# EasyEDA Pro project ProPrj_V1_2025-01-17.epro, board PCB1
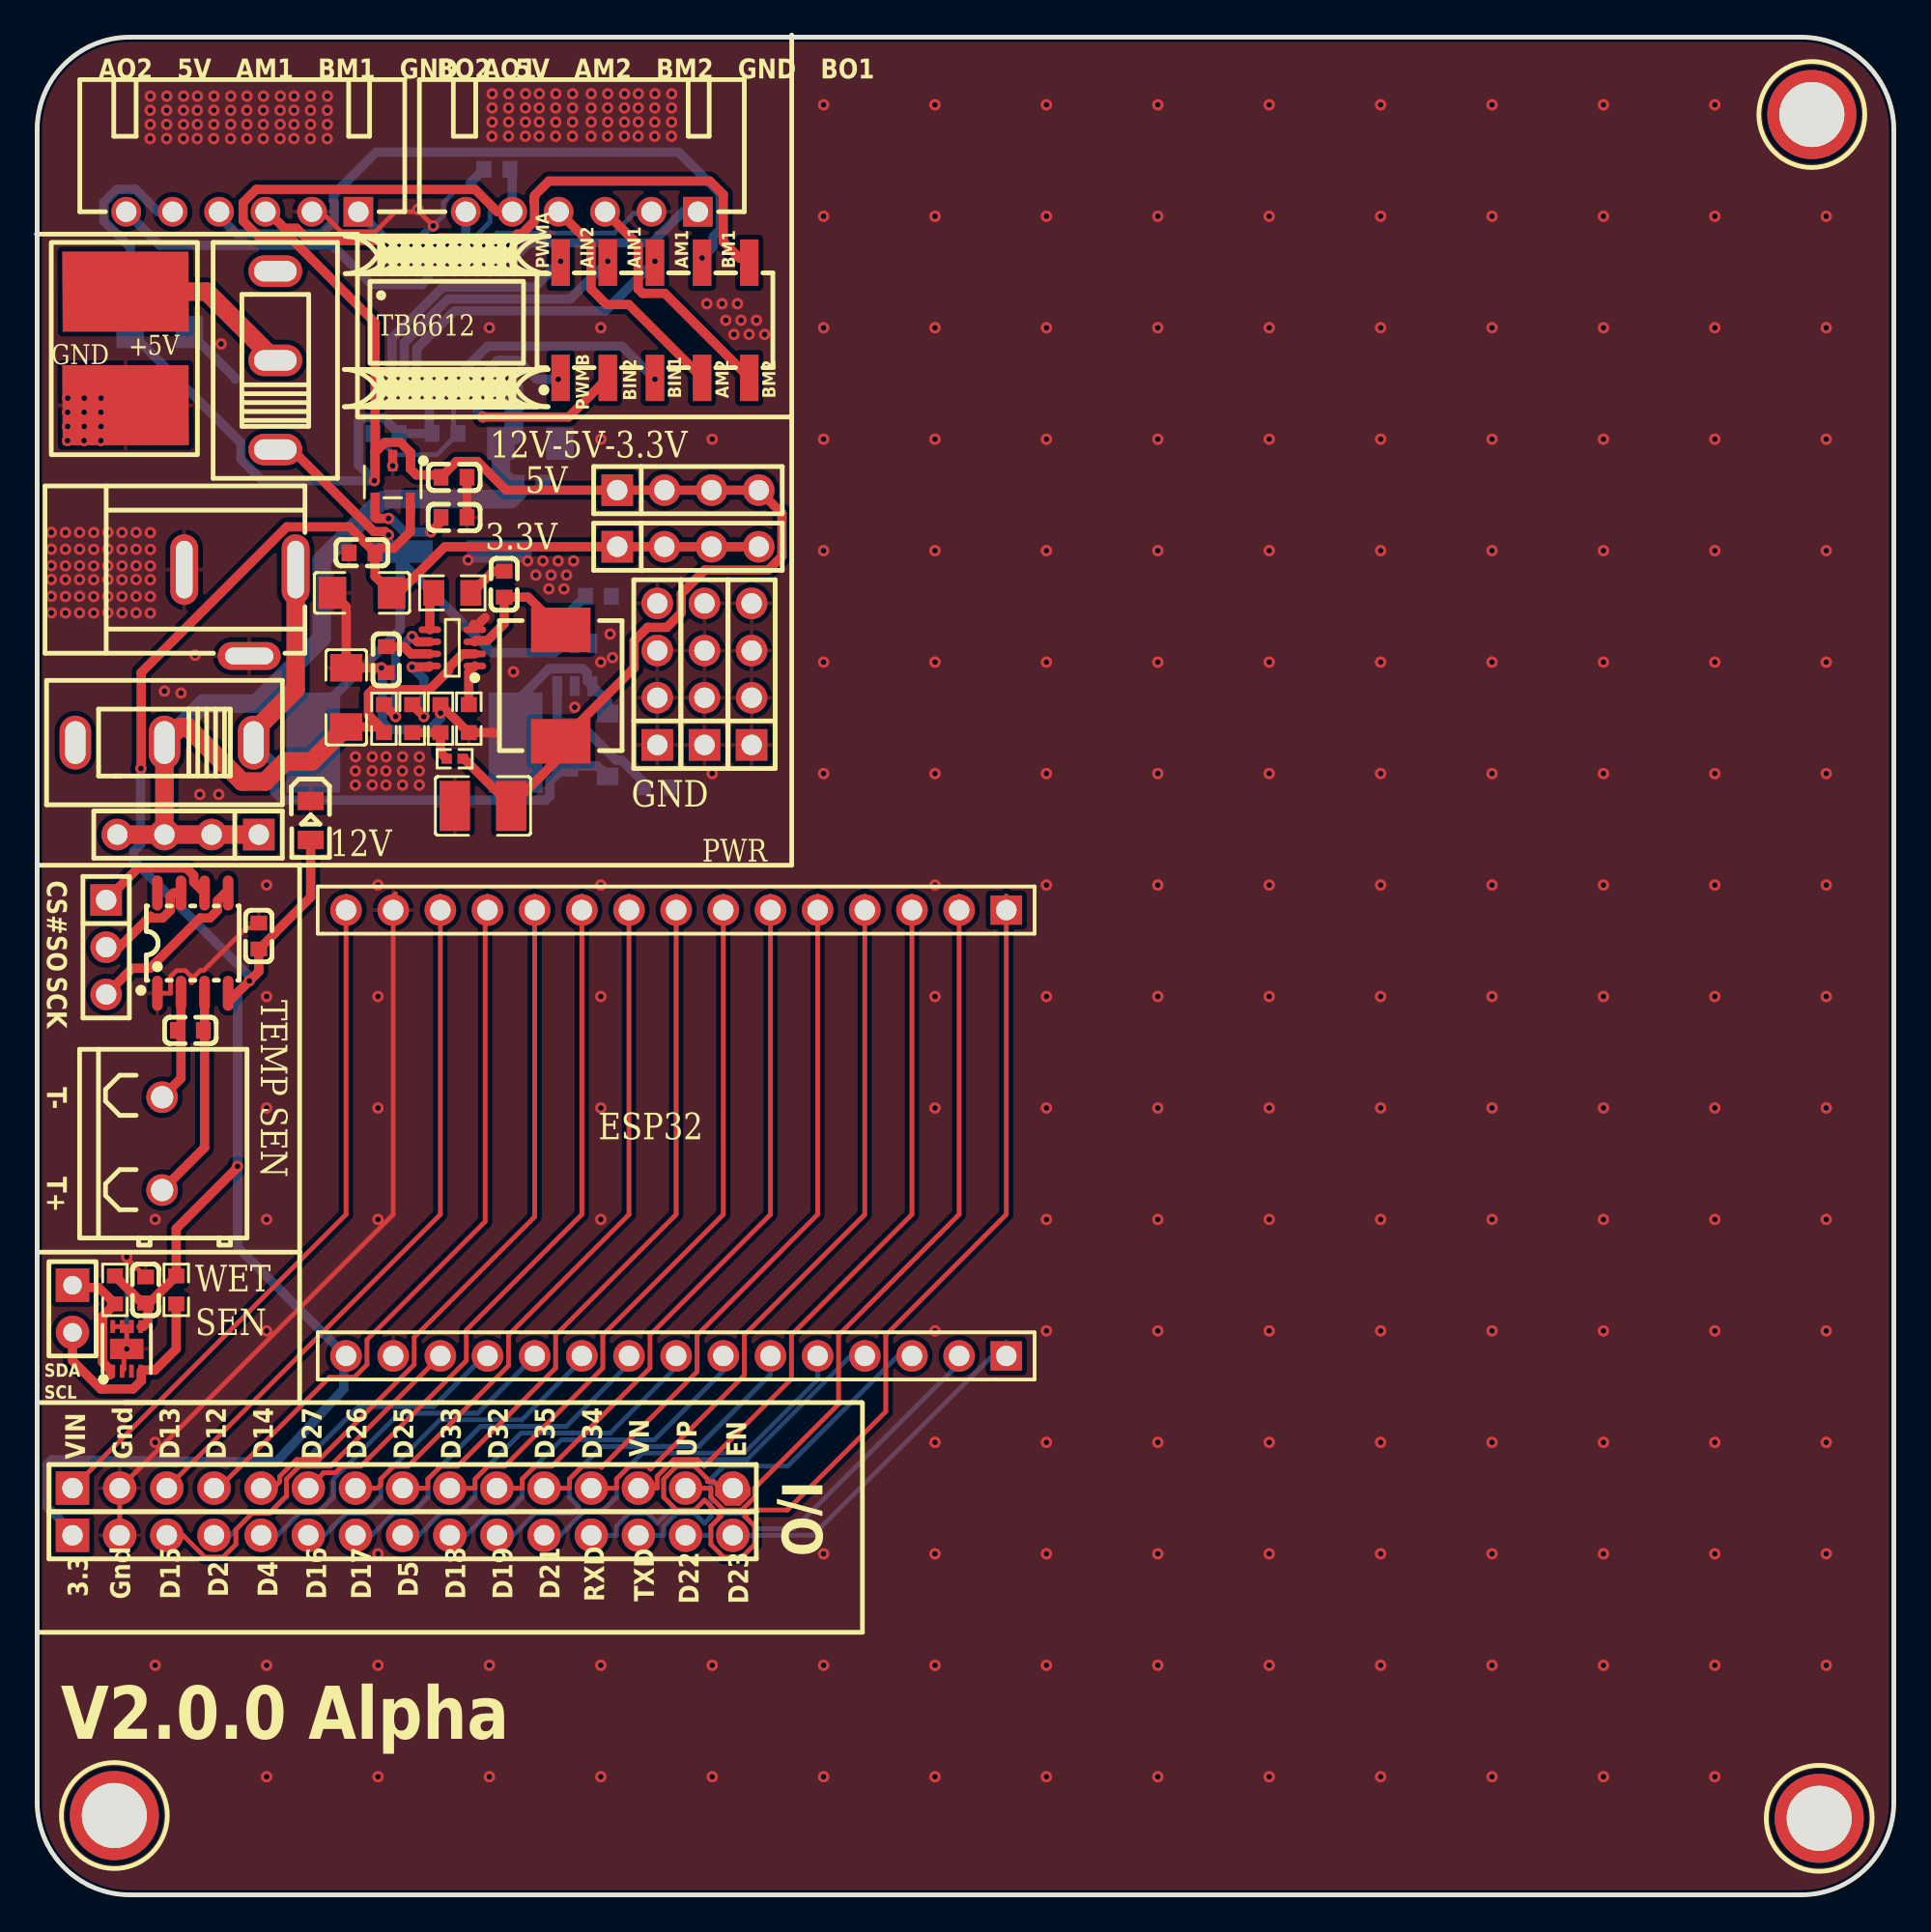
[diagram p1: board, top side]
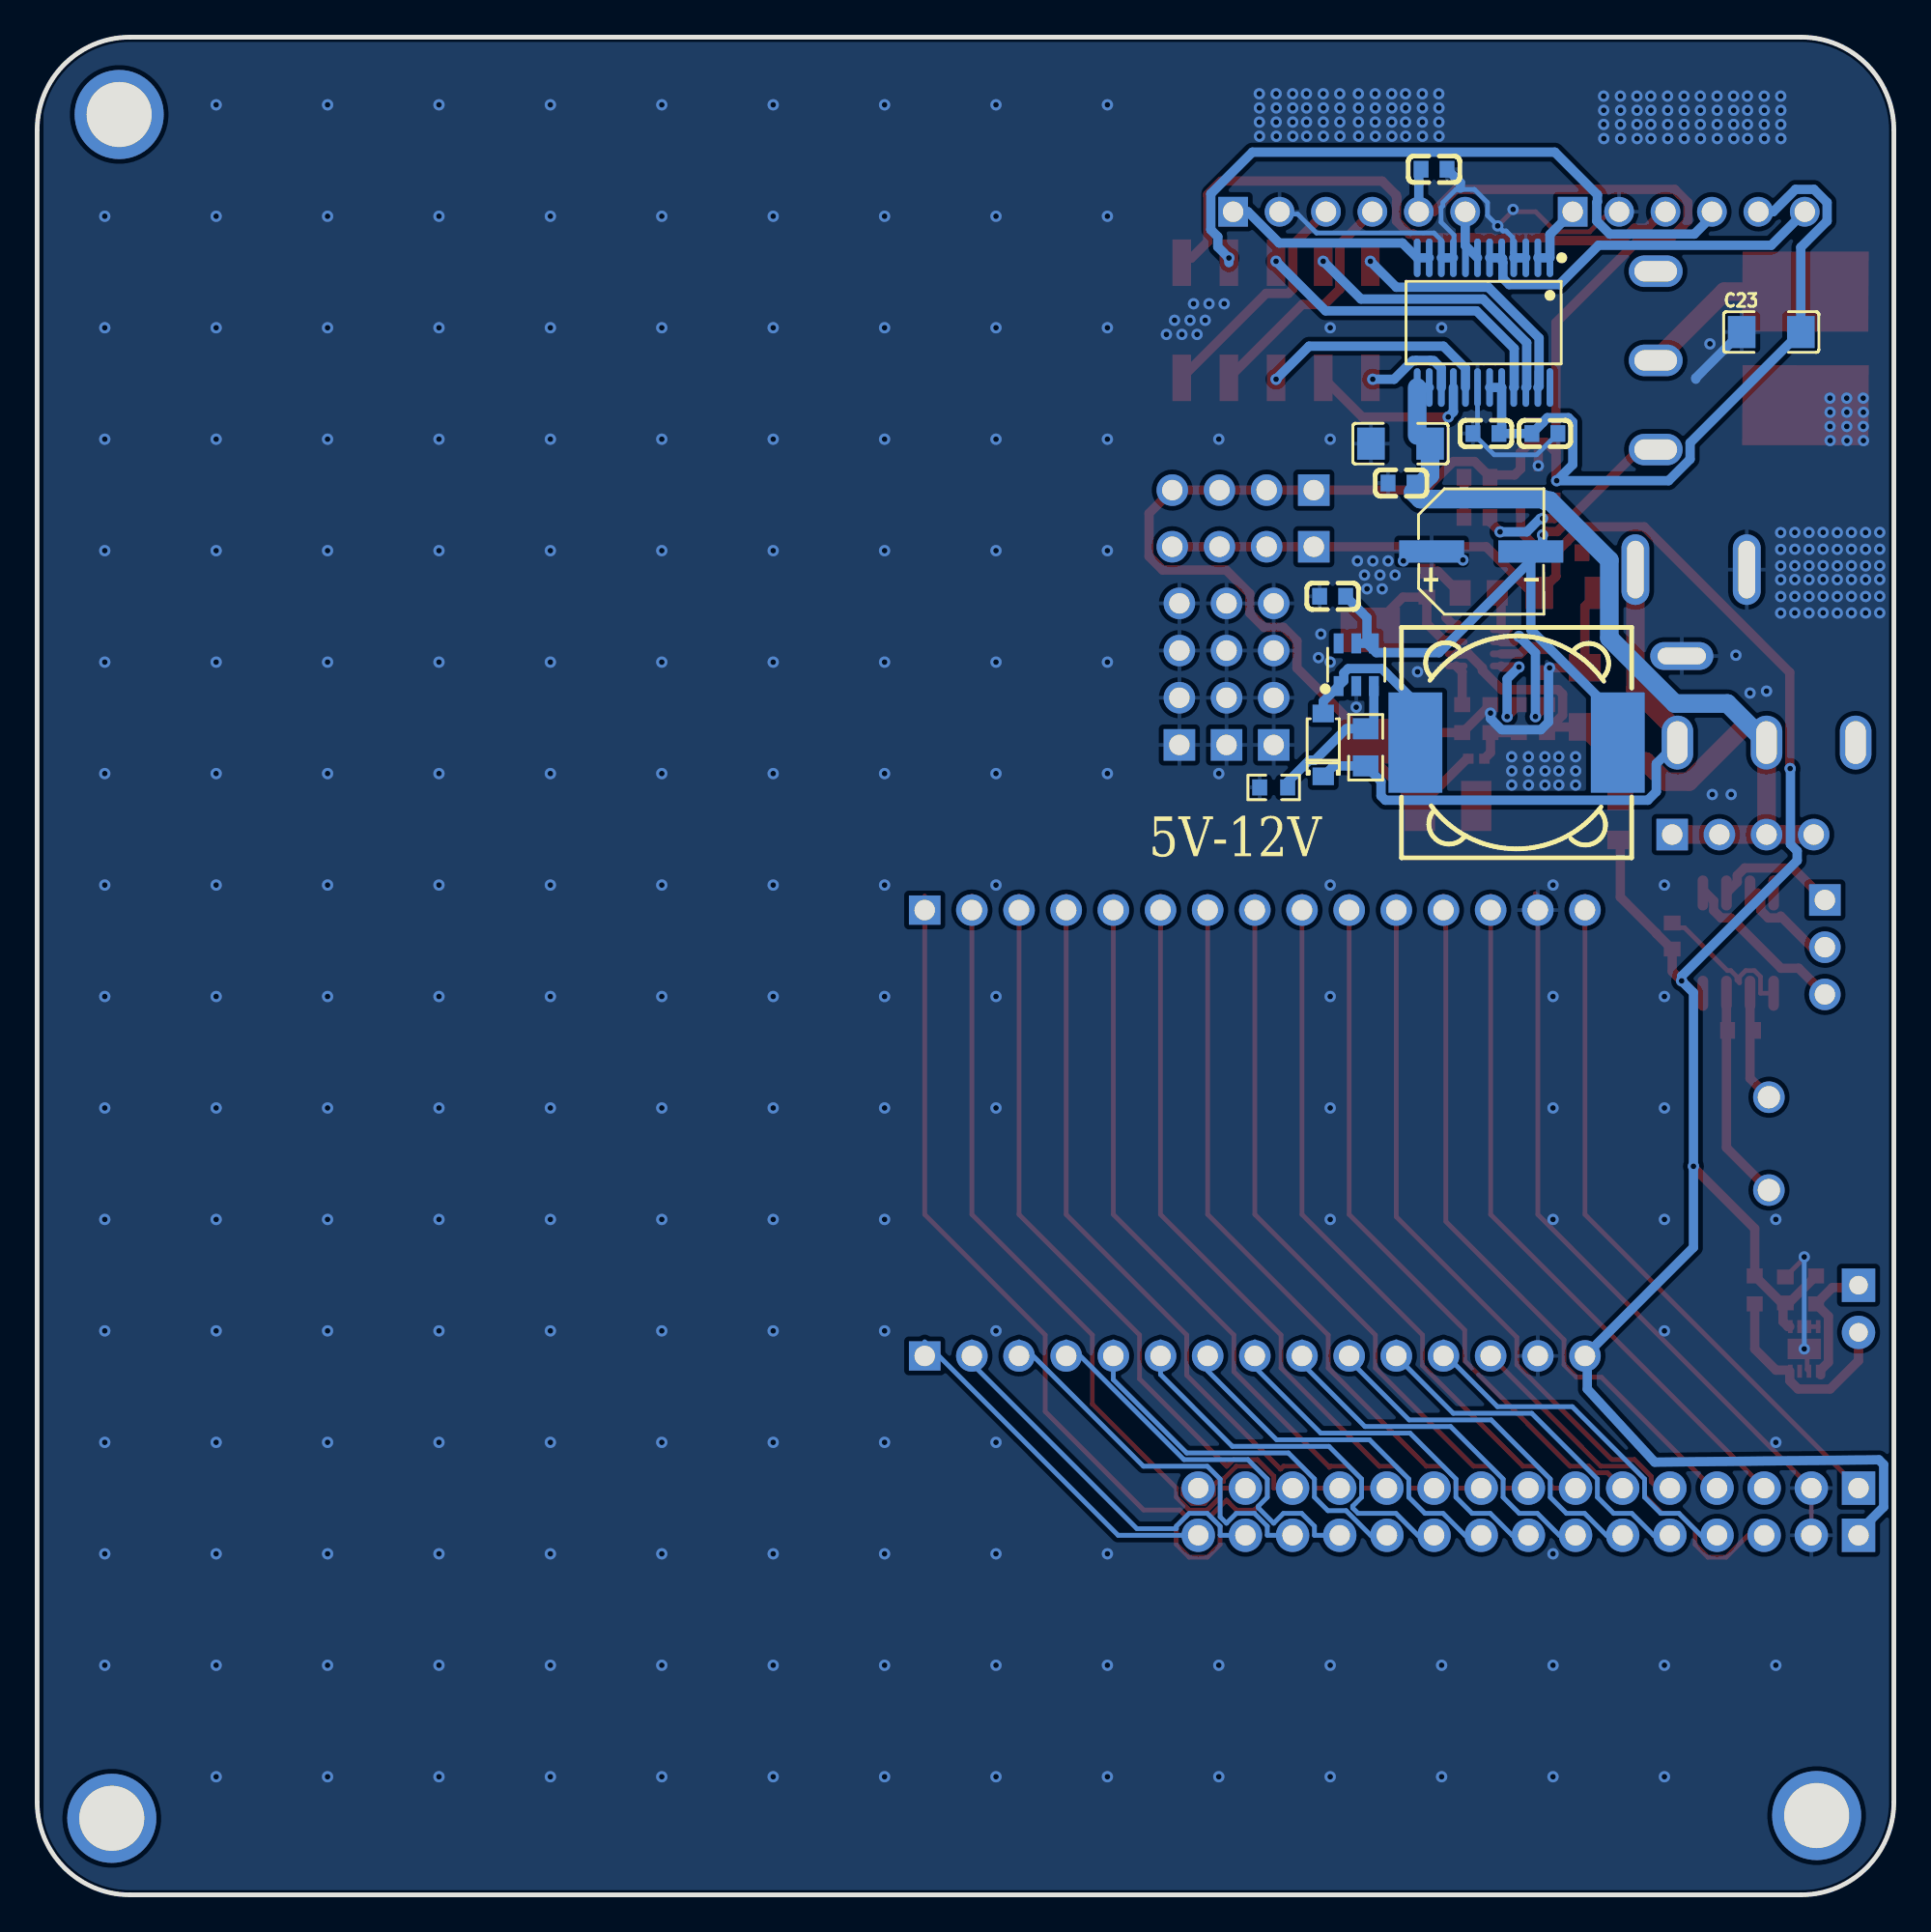
[diagram p2: board, bottom side, seen from below]

Outline 100 x 100 mm; copper layers: Top Layer, Bottom Layer. Coordinates in mm from the lower left corner of the outline.
Outline path: 0,95 0,5 arc(1.46,1.46) 5,0 95,0 arc(98.54,1.46) 100,5 100,95 arc(98.54,98.54) 95,100 5,100 arc(1.46,98.54) 0,95
Stack: Top Layer 0.035mm / Dielectric1 1.51mm FR4 er 4.5 / Bottom Layer 0.035mm

## Design rules (mm)
template: 自定义配置
spacing copperThickness1oz (default): track to track 0.102, other pairs 0.152 to 0.3
spacing copperThickness2oz: track to track 0.203, other pairs 0.152 to 0.3
track width copperThickness1oz (default): min 0.127, default 0.5, max 2.54
track width copperThickness2oz: min 0.203, default 0.254, max 2.54
differential pair differentialPair (default): width min 0.127, default 0.254, max 2.54; gap min 0.152, default 0.152
via viaSize (default): diameter min 0.5, default 0.61, max 10; hole min 0.3, default 0.305, max 6.3

## Placement (name value [footprint] x y rotation side)
C5  22uF  [C1206]  16.65 64.46 270 top
C6  100nF  [C0603]  18.8 66.49 90 top
C7  47uF  [C1210]  24.01 58.62 0 top
C8  100nF  [C0603]  25.15 70.56 90 top
C9  1uF  [C0603]  22.45 76.31 180 top
C10  22nF  [C0603]  22.45 74.15 180 top
C11  10uF  [C1206]  17.5 70.08 0 top
C12  100nF  [C0603]  17.5 72.24 0 top
C15  100nF  [C0603]  24.77 92.89 180 bottom
C16  100nF  [C0603]  26.54 76 0 bottom
C17  10uF  [C1206]  26.57 78.12 0 bottom
C18  100nF  [C0603]  18.8 78.66 0 bottom
C19  100nF  [C0603]  21.97 78.66 180 bottom
C20  100nF  [C0603]  11.94 51.61 90 top
C21  10nF  [C0603]  8.25 46.53 0 top
C22  100nF  [C0603]  5.84 32.56 270 top
C23  22uF  [C1206]  6.6 84.12 180 bottom
C24  100nF  [C0603]  30.23 69.9 180 bottom
C25  22uF  [CAP-SMD_BD6.3-L6.6-W6.6-FD]  22.22 72.31 180 bottom
CN1  X8821WR-06S-N0SN  [CONN-TH_6P-P2.50_X8821WR-06S-N2SN]  29.34 90.6 180 top
CN2  X8821WR-06S-N0SN  [CONN-TH_6P-P2.50_X8821WR-06S-N2SN]  11.05 90.6 180 top
D9  B5819W  [SOD-123_L2.8-W1.8-LS3.7-RD]  30.73 61.9 90 bottom
DC1  DC-005-A200  [DC-IN-TH_DC-005-A200]  10.92 69.01 0 top
H1-12  PZ254V-11-04P  [HDR-TH_4P-P2.54-V-M]  8.13 57.07 180 top
H2  PZ254V-11-04P  [HDR-TH_4P-P2.54-V-M]  33.4 65.71 90 top
H3-5  PZ254V-11-04P  [HDR-TH_4P-P2.54-V-M]  35.05 75.62 0 top
H4  PZ254V-11-04P  [HDR-TH_4P-P2.54-V-M]  38.48 65.71 90 top
H5-3.3  PZ254V-11-04P  [HDR-TH_4P-P2.54-V-M]  35.05 72.57 0 top
H6  PZ254V-11-04P  [HDR-TH_4P-P2.54-V-M]  35.94 65.71 90 top
H7  HC-PZ254-11.5L-1x15PZ  [HDR-TH_15P-P2.54-V-M-1]  19.69 21.9 0 top
H8  HC-PZ254-11.5L-1x15PZ  [HDR-TH_15P-P2.54-V-M-1]  19.69 19.36 0 top
H11  IPCP254M10PB28S  [HDR-SMD_10P-P2.54-V-M-R2-C5-S2.54-LS7.3]  33.27 84.76 0 top
H12  PZ254V-11-03P  [HDR-TH_3P-P2.54-V-M]  3.72 51.01 270 top
H13  -  [HDR-TH_2P-P2.54-V-M-1]  1.91 31.55 270 top
L2  6.8uH  [IND-SMD_L7.0-W6.6]  28.2 65.09 270 top
L3  33uH  [IND-SMD_L12.3-W12.3]  20.32 62.03 180 bottom
LED1  NCD0805R1  [LED0805-R-RD]  14.73 57.84 270 top
R5  100kΩ  [R0603]  18.68 63.32 270 top
R6  75kΩ  [R0603]  23.25 63.32 270 top
R7  20kΩ  [R0603]  20.2 63.32 270 top
R8  40.2kΩ  [R0402]  22.49 61.16 0 top
R9  7.5kΩ  [R0603]  21.73 63.32 270 top
R10  20Ω  [R0805]  22.36 70.08 180 top
R16  10kΩ  [R0603]  7.49 32.56 90 top
R17  10kΩ  [R0603]  4.19 32.56 90 top
R18  19kΩ  [R0805]  28.45 61.77 90 bottom
R19  1kΩ  [R0603]  33.4 59.61 180 bottom
U2  MP2315GJ-Z  [TSOT-23-8_L2.9-W1.6-P0.65-LS2.8-BR]  22.36 67.13 0 top
U3  RT9193-33GB  [SOT-23-5_L3.0-W1.7-P0.95-LS2.8-BL]  19.15 76.05 180 top
U4  SS12D10G5  [SW-TH_SHOU-HAN_SS12D10G4]  6.86 62.03 180 top
U5  -  [SMD_BD4.2-L4.7-W4.7-D3.0]  95.98 4.12 0 top
U5-M1  KH-2.54FH-1X15P-H8.5  [HDR-TH_15P-P2.54-V-F]  34.42 53.01 180 top
U6-M1  KH-2.54FH-1X15P-H8.5  [HDR-TH_15P-P2.54-V-F]  34.42 29.01 180 top
U7  -  [SMD_BD4.2-L4.7-W4.7-D3.0]  4.16 4.27 0 top
U12  -  [SMD_BD4.2-L4.7-W4.7-D3.0]  95.58 95.84 0 top
U24  TB6612FNG(O,C,8,EL  [SSOP-24_L8.4-W5.8-P0.65-LS7.8-BL]  22.1 84.63 0 bottom
U25  MAX31855KASA+T  [SO-8_L4.9-W3.9-P1.27-LS5.9-BL]  8.38 51.23 0 top
U26  -  [CONN-TH_DB302-5.0-2P]  6.73 40.44 270 top
U27  SHT30-DIS-B10KS  [DFN-8_L2.5-W2.5-P0.50-BL-EP]  4.83 29.39 0 top
U29  SS12D10G5  [SW-TH_SHOU-HAN_SS12D10G4]  12.83 82.6 90 top
U30  MT3608  [SOT-23-6_L2.9-W1.6-P0.95-LS2.8-BL]  28.96 66.22 180 bottom
U31  -  [PWR]  8.64 88.95 270 top

## Footprints (pads in the part's own frame, mm; a bottom-side part is the same pattern mirrored in y, then rotated)
C0603
  rect 0.8x0.9 smd: 1(-0.7,0) 2(0.7,0)
C1206
  rect 1.485x1.728 smd: 1(-1.593,0) 2(1.593,0)
C1210
  rect 1.635x2.7 smd: 1(-1.518,0) 2(1.518,0)
CAP-SMD_BD6.3-L6.6-W6.6-FD
  rect 3.5x1.2 smd: 1(-2.67,0) 2(2.67,0)
CONN-TH_6P-P2.50_X8821WR-06S-N2SN
  rect 1.6x1.6 hole 1.1: 1(-6.25,0)
  round 1.6 hole 1.1: 2(-3.75,0) 3(-1.25,0) 4(1.25,0) 5(3.75,0) 6(6.25,0)
CONN-TH_DB302-5.0-2P
  round 1.7 hole 1.2: 1(-2.5,0) 2(2.5,0)
DC-IN-TH_DC-005-A200
  oval 1.5x3.8 hole 0.9x3.1: 1(2.999,2.325) 2(-3,2.325)
  oval 3.4x1.5 hole 2.6x0.9: 3(0.5,-2.325)
DFN-8_L2.5-W2.5-P0.50-BL-EP
  rect 0.25x0.7 smd: 1(-0.75,-1.2) 2(-0.25,-1.2) 3(0.25,-1.2) 4(0.75,-1.2) 5(0.75,1.2) 6(0.25,1.2) 7(-0.25,1.2) 8(-0.75,1.2)
  rect 1.8x1.1 smd: 9(0,0)
HDR-SMD_10P-P2.54-V-M-R2-C5-S2.54-LS7.3
  rect 1x2.5 smd: 1(-5.08,-3.1) 2(-5.08,3.1) 3(-2.54,-3.1) 4(-2.54,3.1) 5(0,-3.1) 6(0,3.1) 7(2.54,-3.1) 8(2.54,3.1) 9(5.08,-3.1) 10(5.08,3.1)
HDR-TH_2P-P2.54-V-M-1
  rect 1.8x1.8 hole 1: 1(-1.27,0)
  round 1.8 hole 1: 2(1.27,0)
HDR-TH_3P-P2.54-V-M
  rect 1.7x1.7 hole 1.1: 1(-2.54,0)
  round 1.7 hole 1.1: 2(0,0) 3(2.54,0)
HDR-TH_4P-P2.54-V-M
  rect 1.7x1.7 hole 1.1: 1(-3.81,0)
  round 1.7 hole 1.1: 2(-1.27,0) 3(1.27,0) 4(3.81,0)
HDR-TH_15P-P2.54-V-F
  rect 1.7x1.575 hole 1.1: 1(-17.78,0)
  round 1.7 hole 1.1: 2(-15.24,0) 3(-12.7,0) 4(-10.16,0) 5(-7.62,0) 6(-5.08,0) 7(-2.54,0) 8(0,0) 9(2.54,0) 10(5.08,0) 11(7.62,0) 12(10.16,0) 13(12.7,0) 14(15.24,0) 15(17.78,0)
HDR-TH_15P-P2.54-V-M-1
  rect 1.8x1.8 hole 1.1: 1(-17.78,0)
  round 1.8 hole 1.1: 2(-15.24,0) 3(-12.7,0) 4(-10.16,0) 5(-7.62,0) 6(-5.08,0) 7(-2.54,0) 8(0,0) 9(2.54,0) 10(5.08,0) 11(7.62,0) 12(10.16,0) 13(12.7,0) 14(15.24,0) 15(17.78,0)
IND-SMD_L7.0-W6.6
  rect 2.4x3.2 smd: 1(-3,0) 2(3,0)
IND-SMD_L12.3-W12.3
  rect 2.9x5.4 smd: 1(-5.45,0) 2(5.45,0)
LED0805-R-RD
  rect 1x1.399 smd: 1(1.05,0) 2(-1.05,0)
PWR
  custom 4.312x6.824 smd: 1(2.648,-3.873) 2(8.763,-3.873)
R0402
  rect 0.566x0.54 smd: 1(-0.433,0) 2(0.433,0)
R0603
  rect 0.806x0.864 smd: 1(-0.753,0) 2(0.753,0)
R0805
  rect 1.133x1.377 smd: 1(-1,0) 2(1,0)
SMD_BD4.2-L4.7-W4.7-D3.0
  round 4.8 hole 3.5: 1(0,0)
SO-8_L4.9-W3.9-P1.27-LS5.9-BL
  oval 0.574x1.888 smd: 1(-1.905,-2.699) 2(-0.635,-2.699) 3(0.635,-2.699) 4(1.905,-2.699) 5(1.905,2.699) 6(0.635,2.699) 7(-0.635,2.699) 8(-1.905,2.699)
SOD-123_L2.8-W1.8-LS3.7-RD
  rect 0.95x1.15 smd: 1(-1.692,0) 2(1.692,0)
SOT-23-5_L3.0-W1.7-P0.95-LS2.8-BL
  rect 0.49x1.157 smd: 1(-0.95,-1.153) 2(0,-1.153) 3(0.95,-1.153)
  rect 0.49x1.175 smd: 4(0.95,1.153) 5(-0.95,1.153)
SOT-23-6_L2.9-W1.6-P0.95-LS2.8-BL
  rect 0.532x1.072 smd: 1(-0.95,-1.149) 2(0,-1.149) 3(0.95,-1.149) 4(0.95,1.149) 5(0,1.149) 6(-0.95,1.149)
SSOP-24_L8.4-W5.8-P0.65-LS7.8-BL
  oval 0.364x2.082 smd: 1(-3.575,-3.491) 2(-2.925,-3.491) 3(-2.275,-3.491) 4(-1.625,-3.491) 5(-0.975,-3.491) 6(-0.325,-3.491) 7(0.325,-3.491) 8(0.975,-3.491) 9(1.625,-3.491) 10(2.275,-3.491) 11(2.925,-3.491) 12(3.575,-3.491) 13(3.575,3.491) 14(2.925,3.491) 15(2.275,3.491) 16(1.625,3.491) 17(0.975,3.491) 18(0.325,3.491) 19(-0.325,3.491) 20(-0.975,3.491) 21(-1.625,3.491) 22(-2.275,3.491) 23(-2.925,3.491) 24(-3.575,3.491)
SW-TH_SHOU-HAN_SS12D10G4
  oval 1.7x2.9 hole 1.1x2.3: 1(-4.8,0) 2(0,0) 3(4.8,0)
TSOT-23-8_L2.9-W1.6-P0.65-LS2.8-BR
  oval 1.222x0.364 smd: 1(1.211,-0.975) 2(1.211,-0.325) 3(1.211,0.325) 4(1.211,0.975) 5(-1.211,0.975) 6(-1.211,0.325) 7(-1.211,-0.325) 8(-1.211,-0.975)

## Nets
As in the schematic.

Pads without a net: U4 3; U5 1; U7 1; U12 1; U25 8; U27 3; U29 3; U30 6

## Via types
v1: diameter 0.61, hole 0.305, Top Layer to Bottom Layer, 409 vias

## Routing (per net, layer and track width the routed paths; a pad name or vN(x,y) marks a point on that pad's centre or on a via; arc(x,y) is an arc through that point)
+3.3V: length 133.2
  Top Layer w0.5: 5.84,31.86 6.04,31.86 R16.2 7.49,35.87 10.73,39.1 ; 5.84,31.86 5.64,31.86 R17.2 ; 5.84,31.86 5.97,31.74 5.97,30.85 5.7,30.59 5.6,30.59 ; C20.1 11.96,50.91 12.79,51.75 12.79,51.77 14.73,53.71 LED1.1 ; C12.2 18.45,72.5 19.22,72.5 20.1,73.38 U3.5 ; C12.2 17.6,72.84 17.6,72.86 16.82,73.64 13.44,73.64 5.61,65.8 5.61,60.65 v1(5.59,60.63) ; C12.2 18.2,70.98 C11.2 19.47,70.08 21.95,72.57 H5-3.3.1 H5-3.3.2 H5-3.3.3 H5-3.3.4 ; 11.94,50.66 11.94,49.71 v1(11.43,49.2) 10.41,48.18
  Bottom Layer w0.5: H8.1 1.78,19.48 1.78,19.65 0.55,20.88 0.55,23.16 0.81,23.42 12.88,23.29 16.51,27.23 16.51,28.88 16.64,29.01 10.8,34.85 v1(10.8,39.22) 10.8,48.57 v1(11.43,49.2) 11.43,49.45 5.21,55.68 5.21,56.19 5.57,56.56 5.57,60.61 v1(5.59,60.63)
+5V: length 129.5
  Top Layer w0.5: 18.2,76.32 18.2,77.65 ; 18.2,77.65 18.74,78.19 19.56,78.19 20.11,77.64 20.11,76.75 20.42,76.43 21.62,76.43 C9.2 21.75,76.33 22.59,77.16 23.72,77.16 25.26,75.62 H3-5.1 H3-5.2 H3-5.3 H3-5.4 40.11,74.36 40.11,72.05 39.38,71.32 35.97,71.32 34.69,70.04 34.69,69 33.92,68.23 32.88,68.23 32.15,67.5 32.15,66.04 L2.2 28.2,61.29 C7.2 22.99,61.16 R8.2 ; 18.2,77.65 18.2,84.63 13.72,89.11 12.09,89.11 11.1,90.1 11.1,91.1 11.8,91.8 23.58,91.8 24.79,90.6 CN1.5
  Bottom Layer w0.5: CN1.5 25.59,92.77 C15.1 ; U24.19 21.12,81.14 21.12,78.81 C19.2 C18.2 18.9,79.26 18.9,79.28 18.66,79.52 17.53,79.52 17.29,79.28 17.29,76.99 v1(18.16,76.12) 12.13,76.12 10.97,77.28 10.97,78.16 C23.2 5.01,88.69 3.6,90.1 3.6,91.1 4.3,91.8 5.3,91.8 6.5,90.6 CN2.5
+12V: length 69.4
  Top Layer w0.5: 23.57,66.8 22.92,66.8 22.16,66.05 22.16,65.91 21.13,64.88 18.08,64.88 17.84,64.64 17.84,63.5 18.68,62.67 R5.2 18.37,62.87 16.65,62.87
  Top Layer w1: H1-12.4 6.73,57.07 ; 6.73,57.07 6.86,57.2 U4.2 7.7,62.87 8.09,62.87 11.04,59.93 12.28,59.93 13.37,61.01 14.79,61.01 16.65,62.87 ; 6.73,57.07 H1-12.3 9.27,57.07 ; H1-12.2 H1-12.1
  Bottom Layer w0.5: U24.13 U24.14
  Bottom Layer w1: U4.2 8.96,64.13 11.8,64.13 15.32,67.66 15.32,71.85 18.53,75.05 18.78,75.05 18.87,75.13 25.51,75.13 25.89,75.52 24.98,76.42 24.98,77.86 ; 25.67,78.56 U24.13
+12VUP: length 33
  Top Layer w1: DC1.1 13.92,64.89 11.66,62.63 U4.1
  Bottom Layer w0.5: D9.1 30.17,60.77 R18.1 27.62,59.95 27.62,59.16 27.39,58.93 13.25,58.93 12.79,59.38 12.79,60.89 U4.1
GND: length 121.5
  Top Layer w0.25: 11.94,52.06 11.27,52.06 8.97,49.75 8.78,49.75 8.45,49.42 8.45,49.24 8.31,49.1 8.31,49.42 7.98,49.75 7.51,49.75 7.18,49.42 7.18,48.53 6.48,48.53
  Top Layer w0.254: U27.7 U27.6 ; U27.7 U27.8 ; U27.7 4.83,30.34 v1(4.83,29.39) 4.67,29.23 4.67,28.28 U27.2 ; C22.1 4.83,34.28 v1(4.83,34.34) ; v1(21.34,89.84) 20.57,90.6 19.29,90.6 18.21,89.52 16.38,89.52 15.3,90.6 CN2.2 ; 4.44,19.23 H7.2 19.18,36.63 19.18,53.77 19.3,53.9
  Top Layer w0.5: C11.1 16.65,69.35 C5.1 v1(18.54,66.05) C6.1 ; 24.13,68.76 23.75,68.38 23.49,68.38 ; C9.1 C10.1 ; R9.1 23.23,62.56 R6.2 24.61,62.56 24.64,62.54
  Bottom Layer w0.254: v1(4.83,34.34) v1(4.83,29.39) ; C18.1 19.24,77.52 21.53,77.52 C19.1 22.42,78.91 U24.18 ; U24.10 24.37,89.07 24.77,89.46 31.1,89.46 32.11,90.48 32.96,90.48 CN1.2 ; U24.9 23.72,88.99 23.69,89.02 23.69,89.34 24.38,90.04 24.38,90.83 24.29,90.93 24.29,91.1 23.58,91.8 23.41,91.8 23.34,91.87 23.27,91.8 22.59,91.8 21.88,91.1 21.88,90.4 21.05,89.57 20.88,89.57 20.54,89.23 20.54,88.39 20.33,88.18 20.33,88.12
  Bottom Layer w0.5: U24.3 U24.4 ; 23.34,91.87 23.34,92.17 C15.2 ; v1(18.54,66.05) 18.6,66 18.6,63.13 19.01,62.72 21.12,62.72 21.73,63.32 v1(21.73,63.62) ; 10.67,81.59 10.67,81.65 C23.1 ; U24.10 U24.9
  vias: v1(0.76,73.34) v1(0.76,72.44) v1(0.76,71.55) v1(0.76,70.8) v1(0.76,69.9) v1(0.76,69.01) v1(1.52,73.34) v1(1.52,72.43) v1(1.52,71.54) v1(1.52,70.8) v1(1.52,69.89) v1(1.52,69) v1(1.65,80.57) v1(1.64,79.81) v1(1.65,79.05) v1(1.64,78.28) v1(2.29,73.34) v1(2.29,72.43) v1(2.29,71.55) v1(2.29,70.8) v1(2.29,69.9) v1(2.29,69.01) v1(2.54,80.57) v1(2.53,79.81) v1(2.53,79.05) v1(2.53,78.28) v1(3.05,73.33) v1(3.05,72.43) v1(3.05,71.54) v1(3.05,70.79) v1(3.05,69.89) v1(3.05,69) v1(3.44,80.57) v1(3.44,79.81) v1(3.44,79.05) v1(3.43,78.28) v1(3.81,73.34) v1(3.81,72.44) v1(3.81,71.55) v1(3.81,70.8) v1(3.81,69.9) v1(3.81,69.01) v1(4.57,73.34) v1(4.57,72.43) v1(4.57,71.54) v1(4.57,70.8) v1(4.57,69.89) v1(4.57,69) v1(5.33,73.34) v1(5.33,72.43) v1(5.33,71.55) v1(5.33,70.8) v1(5.33,69.9) v1(5.33,69.01) v1(6.1,96.83) v1(6.09,96.06) v1(6.09,95.3) v1(6.08,94.54) v1(6.1,73.33) v1(6.1,72.43) v1(6.1,71.54) v1(6.1,70.79) v1(6.1,69.89) v1(6.1,69) v1(6.36,36.36) v1(6.36,24.36) v1(6.36,12.36) v1(6.86,64.8) v1(6.98,96.83) v1(6.98,96.06) v1(6.98,95.3) v1(6.97,94.54) v1(7.75,64.69) v1(7.89,96.83) v1(7.88,96.06) v1(7.89,95.3) v1(7.88,94.54) v1(8.51,66.73) v1(8.63,96.83) v1(8.63,96.06) v1(8.63,95.3) v1(8.62,94.54) v1(8.76,59.23) v1(9.52,96.06) v1(9.52,95.3) v1(9.51,94.54) v1(9.52,96.83) v1(9.78,59.23) v1(9.91,83.49) v1(10.42,96.06) v1(10.42,94.54) v1(10.43,96.83) v1(10.42,95.3) v1(11.3,96.83) v1(11.29,96.06) v1(11.3,95.3) v1(11.29,94.54) v1(12.19,96.83) v1(12.18,96.06) v1(12.19,95.3) v1(12.18,94.54) v1(12.36,54.36) v1(12.36,48.36) v1(12.36,42.36) v1(12.36,36.36) v1(12.36,30.36) v1(12.36,12.36) v1(12.36,6.36) v1(13.1,96.83) v1(13.09,96.06) v1(13.09,95.3) v1(13.08,94.54) v1(13.84,96.83) v1(13.83,96.06) v1(13.84,95.3) v1(13.83,94.54) v1(14.72,94.54) v1(14.73,96.83) v1(14.72,96.06) v1(14.73,95.3) v1(15.63,96.83) v1(15.63,96.06) v1(15.63,95.3) v1(15.62,94.54) v1(17.14,61.27) v1(17.14,60.5) v1(17.14,59.74) v1(18.05,61.27) v1(18.04,60.5) v1(18.04,59.74) v1(18.36,54.36) v1(18.36,48.36) v1(18.36,42.36) v1(18.36,36.36) v1(18.36,18.36) v1(18.36,12.36) v1(18.36,6.36) v1(18.79,61.27) v1(18.79,60.5) v1(18.79,59.74) v1(19.15,76.93) v1(19.68,61.27) v1(19.67,60.5) v1(19.68,59.74) v1(20.51,90.73) v1(20.59,61.27) v1(20.58,60.5) v1(20.58,59.74) v1(23.21,71.85) v1(24.36,84.36) v1(24.36,12.36) v1(24.36,6.36) v1(24.51,96.95) v1(24.5,96.19) v1(24.51,95.43) v1(24.5,94.67) v1(25.4,96.95) v1(25.39,96.19) v1(25.39,95.43) v1(25.39,94.67) v1(25.65,65.84) v1(26.3,96.95) v1(26.3,96.19) v1(26.3,95.43) v1(26.29,94.67) v1(26.42,71.81) v1(26.86,71.04) v1(27.05,96.95) v1(27.04,96.19) v1(27.04,95.43) v1(27.04,94.67) v1(27.24,71.81) v1(27.56,70.3) v1(27.68,71.04) v1(27.94,96.95) v1(27.93,96.19) v1(27.93,95.43) v1(27.93,94.67) v1(28.06,71.81) v1(28.38,70.3) v1(28.51,71.04) v1(28.84,96.95) v1(28.83,96.19) v1(28.84,95.43) v1(28.83,94.67) v1(28.89,71.81) v1(28.96,63.93) v1(29.84,96.95) v1(29.84,96.19) v1(29.84,95.43) v1(29.83,94.67) v1(30.36,84.36) v1(30.36,78.36) v1(30.36,66.36) v1(30.36,54.36) v1(30.36,48.36) v1(30.36,42.36) v1(30.36,36.36) v1(30.36,12.36) v1(30.36,6.36) v1(30.73,96.95) v1(30.73,96.19) v1(30.73,95.43) v1(30.72,94.67) v1(30.86,67.87) v1(30.99,66.6) v1(31.64,96.95) v1(31.63,96.19) v1(31.63,95.43) v1(31.63,94.67) v1(32.38,96.95) v1(32.37,96.19) v1(32.38,95.43) v1(32.37,94.67) v1(33.27,96.95) v1(33.26,96.19) v1(33.27,95.43) v1(33.26,94.67) v1(34.18,96.95) v1(34.17,96.19) v1(34.17,95.43) v1(34.16,94.67) v1(36.07,85.65) v1(36.36,78.36) v1(36.36,60.36) v1(36.36,12.36) v1(36.36,6.36) v1(36.89,85.65) v1(37.09,84.76) v1(37.53,84) v1(37.72,85.65) v1(37.91,84.76) v1(38.35,84) v1(38.74,84.76) v1(39.18,84) v1(42.36,96.36) v1(42.36,90.36) v1(42.36,84.36) v1(42.36,78.36) v1(42.36,72.36) v1(42.36,66.36) v1(42.36,60.36) v1(42.36,18.36) v1(42.36,12.36) v1(42.36,6.36) v1(48.36,96.36) v1(48.36,90.36) v1(48.36,84.36) v1(48.36,78.36) v1(48.36,72.36) v1(48.36,66.36) v1(48.36,60.36) v1(48.36,54.36) v1(48.36,48.36) v1(48.36,42.36) v1(48.36,30.36) v1(48.36,24.36) v1(48.36,18.36) v1(48.36,12.36) v1(48.36,6.36) v1(54.36,96.36) v1(54.36,90.36) v1(54.36,84.36) v1(54.36,78.36) v1(54.36,72.36) v1(54.36,66.36) v1(54.36,60.36) v1(54.36,54.36) v1(54.36,48.36) v1(54.36,42.36) v1(54.36,36.36) v1(54.36,30.36) v1(54.36,24.36) v1(54.36,18.36) v1(54.36,12.36) v1(54.36,6.36) v1(60.36,96.36) v1(60.36,90.36) v1(60.36,84.36) v1(60.36,78.36) v1(60.36,72.36) v1(60.36,66.36) v1(60.36,60.36) v1(60.36,54.36) v1(60.36,48.36) v1(60.36,42.36) v1(60.36,36.36) v1(60.36,30.36) v1(60.36,24.36) v1(60.36,18.36) v1(60.36,12.36) v1(60.36,6.36) v1(66.36,96.36) v1(66.36,90.36) v1(66.36,84.36) v1(66.36,78.36) v1(66.36,72.36) v1(66.36,66.36) v1(66.36,60.36) v1(66.36,54.36) v1(66.36,48.36) v1(66.36,42.36) v1(66.36,36.36) v1(66.36,30.36) v1(66.36,24.36) v1(66.36,18.36) v1(66.36,12.36) v1(66.36,6.36) v1(72.36,96.36) v1(72.36,90.36) v1(72.36,84.36) v1(72.36,78.36) v1(72.36,72.36) v1(72.36,66.36) v1(72.36,60.36) v1(72.36,54.36) v1(72.36,48.36) v1(72.36,42.36) v1(72.36,36.36) v1(72.36,30.36) v1(72.36,24.36) v1(72.36,18.36) v1(72.36,12.36) v1(72.36,6.36) v1(78.36,96.36) v1(78.36,90.36) v1(78.36,84.36) v1(78.36,78.36) v1(78.36,72.36) v1(78.36,66.36) v1(78.36,60.36) v1(78.36,54.36) v1(78.36,48.36) v1(78.36,42.36) v1(78.36,36.36) v1(78.36,30.36) v1(78.36,24.36) v1(78.36,18.36) v1(78.36,12.36) v1(78.36,6.36) v1(84.36,96.36) v1(84.36,90.36) v1(84.36,84.36) v1(84.36,78.36) v1(84.36,72.36) v1(84.36,66.36) v1(84.36,60.36) v1(84.36,54.36) v1(84.36,48.36) v1(84.36,42.36) v1(84.36,36.36) v1(84.36,30.36) v1(84.36,24.36) v1(84.36,18.36) v1(84.36,12.36) v1(84.36,6.36) v1(90.36,96.36) v1(90.36,90.36) v1(90.36,84.36) v1(90.36,78.36) v1(90.36,72.36) v1(90.36,66.36) v1(90.36,60.36) v1(90.36,54.36) v1(90.36,48.36) v1(90.36,42.36) v1(90.36,36.36) v1(90.36,30.36) v1(90.36,24.36) v1(90.36,18.36) v1(90.36,12.36) v1(90.36,6.36) v1(96.36,90.36) v1(96.36,84.36) v1(96.36,78.36) v1(96.36,72.36) v1(96.36,66.36) v1(96.36,60.36) v1(96.36,54.36) v1(96.36,48.36) v1(96.36,42.36) v1(96.36,36.36) v1(96.36,30.36) v1(96.36,24.36) v1(96.36,18.36) v1(96.36,12.36)
AIN1: length 16.9
  Bottom Layer w0.5: v1(33.27,87.94) 30.61,85.27 22.48,85.27 20.45,83.24 20.45,81.17 U24.21
AIN2: length 15.2
  Bottom Layer w0.5: v1(30.73,87.94) 28.7,85.9 22.12,85.9 19.77,83.55 19.77,81.19 U24.22
AM1: length 35.4
  Bottom Layer w0.5: H11.8 v1(35.81,88.11) 36.41,88.71 36.41,89.26 36.79,89.64 36.79,91.57 34.55,93.81 18.26,93.81 15.97,91.52 15.97,91.14 16,91.1 16,90.1 15.3,89.4 10.75,89.4 9.8,90.35 CN2.4
AM2: length 12.8
  Top Layer w0.5: CN1.4 29.83,88.86 29.83,86.44 30.67,85.61 31.87,85.61 H11.7
AO1: length 3.6
  Bottom Layer w0.5: U24.2 U24.1 18.52,89.38 CN2.1
AO2: length 19.8
  Bottom Layer w0.5: U24.6 21.12,88.12 21.08,88.08 21.08,87.87 21.06,87.86 21.06,87.02 20.71,86.68 18.02,86.68 15.9,88.8 6.6,88.8 CN2.6
BIN1: length 12.5
  Bottom Layer w0.5: v1(33.27,81.59) 31.5,83.36 24.26,83.36 23.07,82.18 U24.17
BIN2: length 9.3
  Top Layer w0.5: H11.3 28.63,79.55 v1(24,79.55)
  Bottom Layer w0.5: U24.16 23.72,79.83 v1(24,79.55)
BM1: length 32.2
  Top Layer w0.5: H11.10 38.1,88.11 37.83,88.11 36.96,88.99 36.96,91.53 36.23,92.25 27.56,92.25 26.8,91.49 26.8,91.39 26.76,91.35 26.76,91.13 26.79,91.1 26.79,90.1 26.08,89.4 25.87,89.4 25.68,89.21 21.7,89.21 21.63,89.13 21.04,89.13 20.97,89.21 18.57,89.21 18.41,89.04 14.64,89.04 13.97,89.71 13.31,89.71 12.43,90.6 CN2.3
BM2: length 12.9
  Top Layer w0.5: H11.9 33.81,86.21 32.61,86.21 32.37,86.44 32.37,88.82 CN1.3
BO1: length 11.6
  Bottom Layer w0.5: CN1.1 34.79,90.6 33.11,88.92 26.47,88.92 U24.12 U24.11
BO2: length 2.8
  Bottom Layer w0.5: CN1.6 23.09,88.79 U24.7
C8: length 7.2
  Top Layer w0.5: L2.1 26.44,69.86 C8.1 25.15,68.43 24.24,67.52 23.64,67.52 U2.3
FB: length 4.8
  Top Layer w0.5: U2.8 21.09,66.09 v1(20.19,66.09) ; R7.1 20.83,63.44 v1(20.83,63.42)
  Bottom Layer w0.5: v1(20.83,63.42) 20.83,65.46 v1(20.19,66.09)
PWMA: length 13.5
  Bottom Layer w0.5: v1(28.19,87.94) 26.8,86.54 21.84,86.54 19.11,83.8 19.11,81.21 U24.23
PWMB: length 5.3
  Bottom Layer w0.5: U24.15 24.37,82.18 24.78,82.59 24.95,82.59 24.97,82.6 25.72,82.6 25.74,82.59 25.91,82.59 26.91,81.59 v1(28.07,81.59)
$1N1735: length 6.7
  Top Layer w0.5: v1(20.19,67.74) 20.48,67.45 U2.6 ; R5.1 19.3,63.44 v1(19.3,63.42)
  Bottom Layer w0.5: v1(20.19,67.74) 19.3,66.85 v1(19.3,63.42)
$1N1737: length 2.5
  Top Layer w0.5: 21.15,66.8 20.13,66.8 19.74,67.19 C6.2
$1N1739: length 2.2
  Top Layer w0.5: R6.1 23.25,65.83 U2.1
$1N1742: length 2
  Top Layer w0.5: 21.36,70.05 21.15,69.84 U2.5
$1N1745: length 3.1
  Top Layer w0.5: R8.1 21.73,61.49 R9.2 R7.2
$1N1755: length 5.1
  Top Layer w0.5: U3.4 18.2,74.17 18.28,74.09 v1(18.92,74.09) ; C10.2 21.75,73.91 v1(21.21,73.37)
  Bottom Layer w0.5: v1(21.21,73.37) 19.77,73.37 19.05,74.09 v1(18.92,74.09)
$1N1765: length 2.3
  Top Layer w0.5: 23.36,70.05 24.57,71.26 C8.2
$1N1767: length 59.1
  Top Layer w0.254: H7.15 38.29,21.9 38.29,21.55 37.81,21.07 37.12,21.07 36.64,21.55 36.64,22.04 36.43,22.25 36.1,22.25 36.1,22.38 35.41,23.07 34.44,23.07 33.75,22.38 33.75,21.41 34.44,20.72 35.41,20.72 35.94,21.25 36.82,20.37 36.29,19.84 36.29,18.87 36.98,18.18 37.95,18.18 38.64,18.87 38.64,19.84 38.11,20.37 38.46,20.72 40.41,20.72 45.71,26.02 45.71,30.14 52.2,36.63 52.2,53.77
$1N1768: length 41.7
  Top Layer w0.254: H7.14 36.29,21.9 36.29,21.41 36.98,20.72 37.95,20.72 38.64,21.41 38.64,21.9 43.17,26.42 43.17,30.14 49.66,36.63 49.66,53.77
$1N1769: length 40
  Top Layer w0.254: H7.13 33.39,21.9 33.39,22.53 34.29,23.43 35.56,23.43 35.92,23.07 40.63,27.78 40.63,30.14 47.12,36.63 47.12,53.77
$1N1770: length 39.7
  Top Layer w0.254: 29.84,21.9 31.21,21.9 31.21,22.38 31.9,23.07 32.87,23.07 33.03,22.92 38.09,27.97 38.09,30.14 44.58,36.63 44.58,53.77
$1N1771: length 39.5
  Top Layer w0.254: 42.04,53.77 42.04,36.63 35.55,30.14 35.55,28.17 30.39,23.01 30.33,23.07 29.36,23.07 28.67,22.38 28.67,21.9 H7.11
$1N1772: length 39.3
  Top Layer w0.254: H7.10 26.13,21.9 26.13,22.38 26.82,23.07 27.72,23.07 33.01,28.36 33.01,30.14 39.5,36.63 39.5,53.77
$1N1773: length 39.3
  Top Layer w0.254: 36.96,53.77 36.96,36.63 30.47,30.14 30.47,28.36 25.18,23.07 24.28,23.07 23.59,22.38 23.59,21.9 H7.9
$1N1774: length 39.3
  Top Layer w0.254: 34.42,53.77 34.42,36.63 27.93,30.14 27.93,28.36 22.64,23.07 21.74,23.07 21.05,22.38 21.05,21.9 H7.8
$1N1775: length 39.1
  Top Layer w0.254: H7.7 18.33,21.9 18.51,22.07 18.51,22.38 19.2,23.07 19.97,23.07 25.39,28.49 25.39,30.14 31.88,36.63 31.88,53.77
$1N1776: length 38.9
  Top Layer w0.254: 29.34,53.77 29.34,36.63 23.11,30.4 23.11,28.75 17.44,23.07 16.42,23.07 16.06,22.72 15.43,22.72 H7.6
$1N1777: length 39.1
  Top Layer w0.254: H7.5 12.73,21.9 13.07,22.24 13.07,22.53 13.97,23.43 15.19,23.43 20.31,28.54 20.31,30.01 26.8,36.5 26.8,53.77
$1N1778: length 38.9
  Top Layer w0.254: 24.26,53.77 24.13,53.65 24.13,36.25 17.77,29.88 17.77,28.54 17.09,27.86 15.75,27.86 9.78,21.9 H7.4
$1N1779: length 38
  Top Layer w0.254: 21.72,53.77 21.72,36.63 H7.3
$1N1781: length 38
  Top Layer w0.254: 16.64,53.77 16.64,36.63 H7.1
$1N1782: length 19
  Bottom Layer w0.254: 52.2,29.77 41.78,19.36 H8.15
$1N1783: length 20.8
  Bottom Layer w0.254: H8.14 36.29,19.36 36.29,19.84 36.98,20.53 37.95,20.53 38.64,19.84 38.64,19.71 40.77,19.71 49.66,28.6 49.66,29.77
$1N1784: length 21
  Bottom Layer w0.254: H8.13 33.75,19.36 33.75,19.84 34.44,20.53 35.41,20.53 35.94,20 36.29,20.35 36.29,22.38 36.98,23.07 40.42,23.07 47.12,29.77
$1N1785: length 21.4
  Bottom Layer w0.254: 29.84,19.36 31.21,19.36 31.21,19.84 31.9,20.53 32.87,20.53 33.4,20 34.23,20.83 34.23,20.92 33.75,21.41 33.75,22.38 34.79,23.43 38.23,23.43 44.58,29.77
$1N1786: length 20.8
  Bottom Layer w0.254: H8.11 28.18,19.36 29.5,20.68 30.48,20.68 31.21,21.41 31.21,22.38 32.61,23.79 38.09,23.79 42.04,27.74 42.04,29.77
$1N1787: length 21.7
  Bottom Layer w0.254: H8.10 25.64,19.36 26.82,20.53 28.85,20.53 29.15,20.83 29.15,20.92 28.67,21.41 28.67,22.38 30.42,24.14 35.63,24.14 39.5,28.01 39.5,29.77
$1N1788: length 20.5
  Bottom Layer w0.254: 36.96,29.77 36.96,28.21 33.25,24.5 28.24,24.5 26.13,22.38 26.13,21.41 25.25,20.53 24.28,20.53 23.1,19.36 H8.9
$1N1789: length 20.4
  Bottom Layer w0.254: 34.42,29.77 34.42,28.4 30.87,24.85 26.06,24.85 23.59,22.38 23.59,21.41 22.71,20.53 21.74,20.53 20.56,19.36 H8.8
$1N1790: length 20.3
  Bottom Layer w0.254: H8.7 18.02,19.36 19.2,20.53 20.17,20.53 21.05,21.41 21.05,22.38 23.87,25.21 28.49,25.21 31.88,28.6 31.88,29.77
$1N1791: length 20.2
  Bottom Layer w0.254: 29.34,29.77 29.34,28.8 26.11,25.57 21.69,25.57 18.51,22.38 18.51,21.41 17.63,20.53 16.66,20.53 15.48,19.36 H8.6
$1N1792: length 20.1
  Bottom Layer w0.254: 26.8,29.77 26.8,28.99 23.73,25.92 19.5,25.92 15.97,22.38 15.97,21.41 15.09,20.53 14.12,20.53 12.94,19.36 H8.5
$1N1793: length 20
  Bottom Layer w0.254: 24.26,29.77 24.26,29.19 21.35,26.28 17.32,26.28 13.43,22.38 13.43,21.41 12.55,20.53 11.58,20.53 10.4,19.36 H8.4
$1N1794: length 20.7
  Top Layer w0.254: H8.3 7.86,19.36 9.04,18.18 10.01,18.18 10.7,18.87 10.7,19.66 11.58,20.53 12.48,20.53 13.43,21.48 13.43,22.38 14.12,23.07 15.78,23.07 21.72,29.01
$1N8770: length 11.5
  Top Layer w0.5: 9.02,48.53 9.02,40.22 U26.2
$1N8790: length 6
  Top Layer w0.5: 7.75,48.53 7.75,43.95 U26.1
$1N8843: length 9.1
  Top Layer w0.5: U25.5 10.13,53.93 9.71,53.51 9.71,52.99 9.3,52.59 8.78,52.59 6.08,49.88 5.12,49.88 H12.3
$1N8845: length 6.8
  Top Layer w0.5: H12.1 5.44,55.28 8.03,55.28 8.44,54.87 8.44,54.51 U25.6
$1N8847: length 5.8
  Top Layer w0.5: U25.7 7.34,53.93 7.17,53.75 7.17,52.99 6.76,52.59 6.19,52.59 6.09,52.68 4.42,51.01 H12.2
$1N11564: length 11.1
  Top Layer w0.5: 1.91,30.15 1.91,28.75 3.43,27.23 5.16,27.23 5.6,27.67 5.6,28.19 ; R16.1 7.49,29.39 6.35,28.25 5.71,28.25
$1N11568: length 6.9
  Top Layer w0.5: 1.91,32.69 3.31,32.69 R17.1 3.52,31.14 3.52,28.67 3.94,28.26 3.94,27.99
$1N19408: length 9.5
  Bottom Layer w0.5: L3.1 25.77,64.2 27.57,66.01 29.39,66.01 29.62,65.77 29.62,65.35 U30.1 30.73,64.24 D9.2
$1N19636: length 8.2
  Bottom Layer w0.5: R19.2 32.65,59.91 31.48,61.08 31.18,61.08 29.49,62.77 R18.2 28.01,63.22 U30.3
$1N19998: length 36.9
  Top Layer w0.5: 12.83,77.8 13.72,77.8 18.14,73.39 18.74,73.39 v1(18.92,73.2)
  Bottom Layer w0.5: U30.5 28.38,67.37 ; 28.38,67.37 U30.4 ; 28.38,67.37 27.88,66.87 24.5,66.87 19.55,71.81 ; 28.38,67.37 28.38,68.75 C24.2 ; C25.2 19.55,71.81 ; 19.55,71.81 19.55,68.1 14.87,63.42 L3.2 ; 19.55,71.81 18.92,72.44 v1(18.92,73.2)
$1N20257: length 9.6
  Top Layer w1: U31.1 9.13,86.3 U29.2

## Copper pours and planes (outline as drawn; the poured copper is in the pictures)
GND on Top Layer: -0.13,100.13 99.87,100.13 99.87,0.13 -0.13,0.13
GND on Bottom Layer: -0.34,99.96 99.66,99.96 99.66,-0.04 -0.34,-0.04

## Text on the board
Bottom Silkscreen Layer: 5V-12V
Top Silkscreen Layer: SDA / SCL | PWMA | PWMB | AIN2 | BIN2 | AIN1 | BIN1 | AM1 | AM2 | BM1 | BM2 | AO2   5V   AM1   BM1   GND   AO1 | BO2   5V   AM2   BM2   GND   BO1 | VIN | 3.3 | Gnd | D13 | D15 | D12 | D2 | D14 | D4 | D27 | D16 | D26 | D17 | D25 | D5 | D33 | D18 | D32 | D19 | D35 | D21 | D34 | RXD | VN | TXD | UP | D22 | EN | D23 | CS# | SO | SCK | T- | T+ | I/O | V2.0.0 Alpha | GND | +5V | TB6612 | PWR | WET / SEN | 3.3V | 5V | ESP32 | TEMP SEN | 12V | 12V-5V-3.3V
